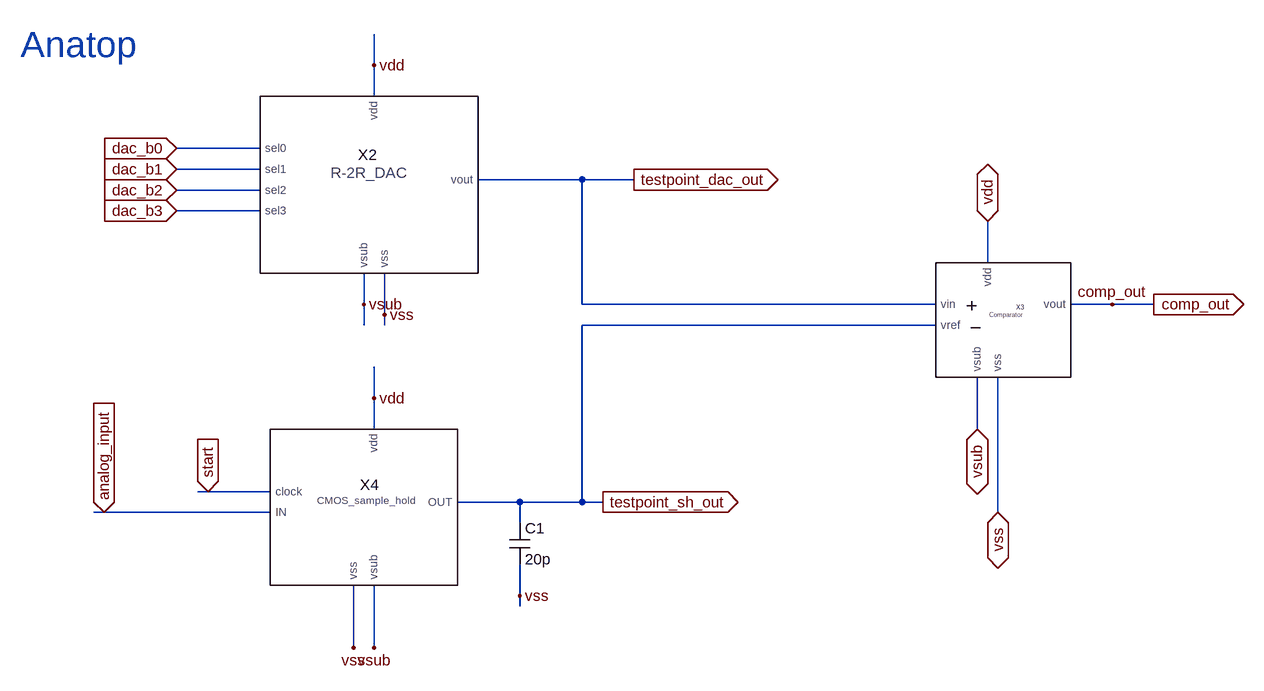
[diagram p0: schematic dsproj_anatop.asc]
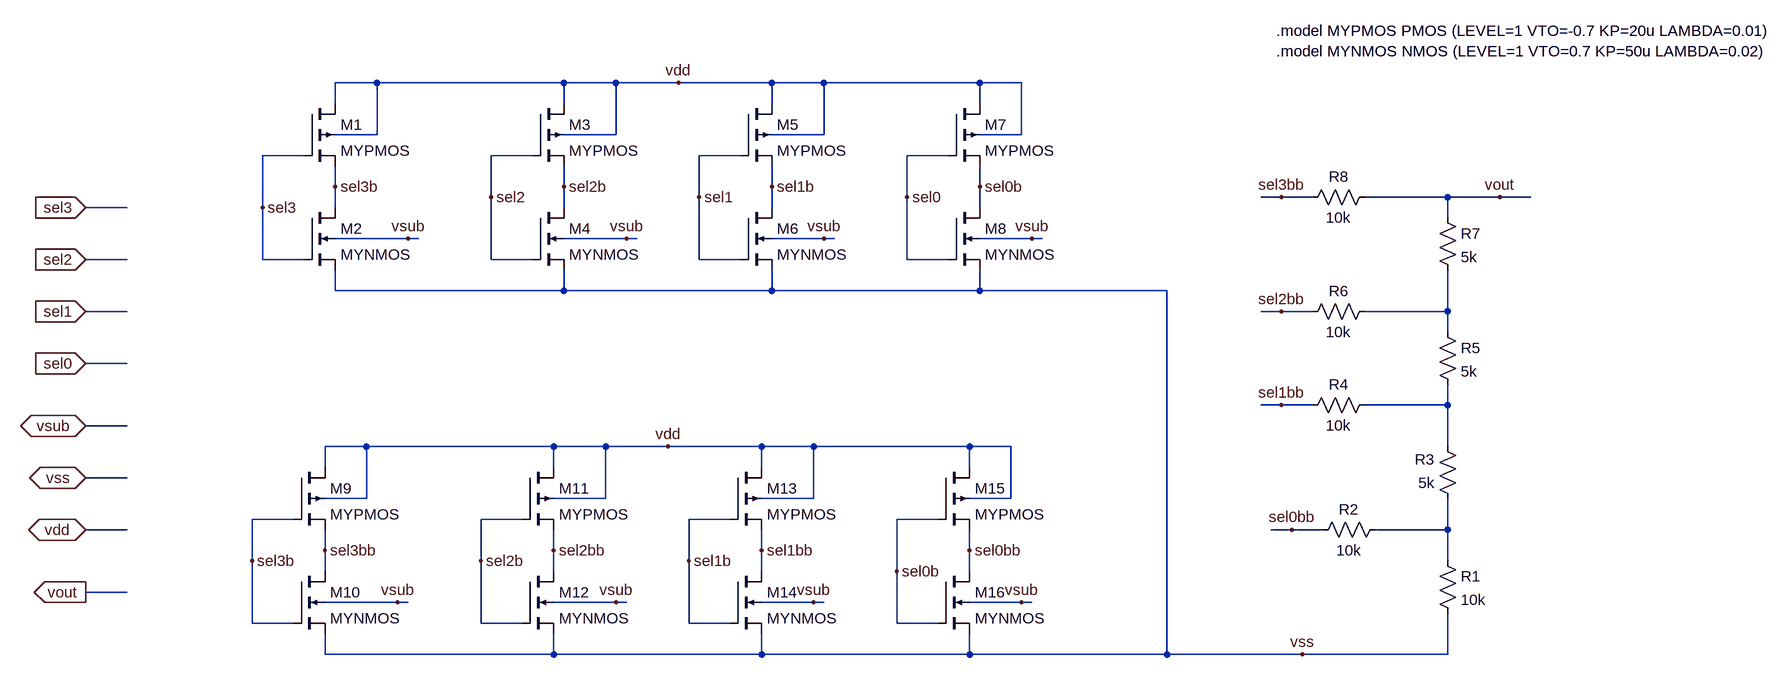
[diagram p1: sub-circuit dsproj_r2rdac.asc]
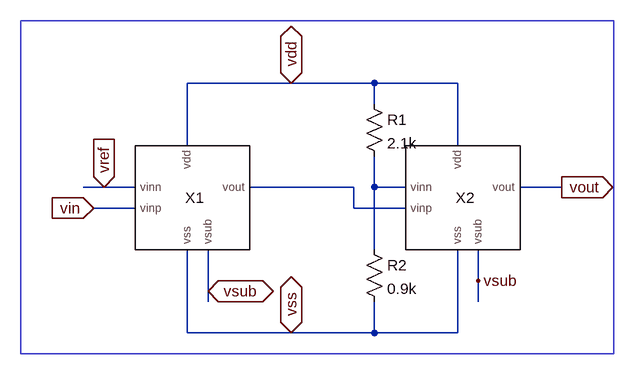
[diagram p2: sub-circuit dsproj_twostagecomparator.asc]
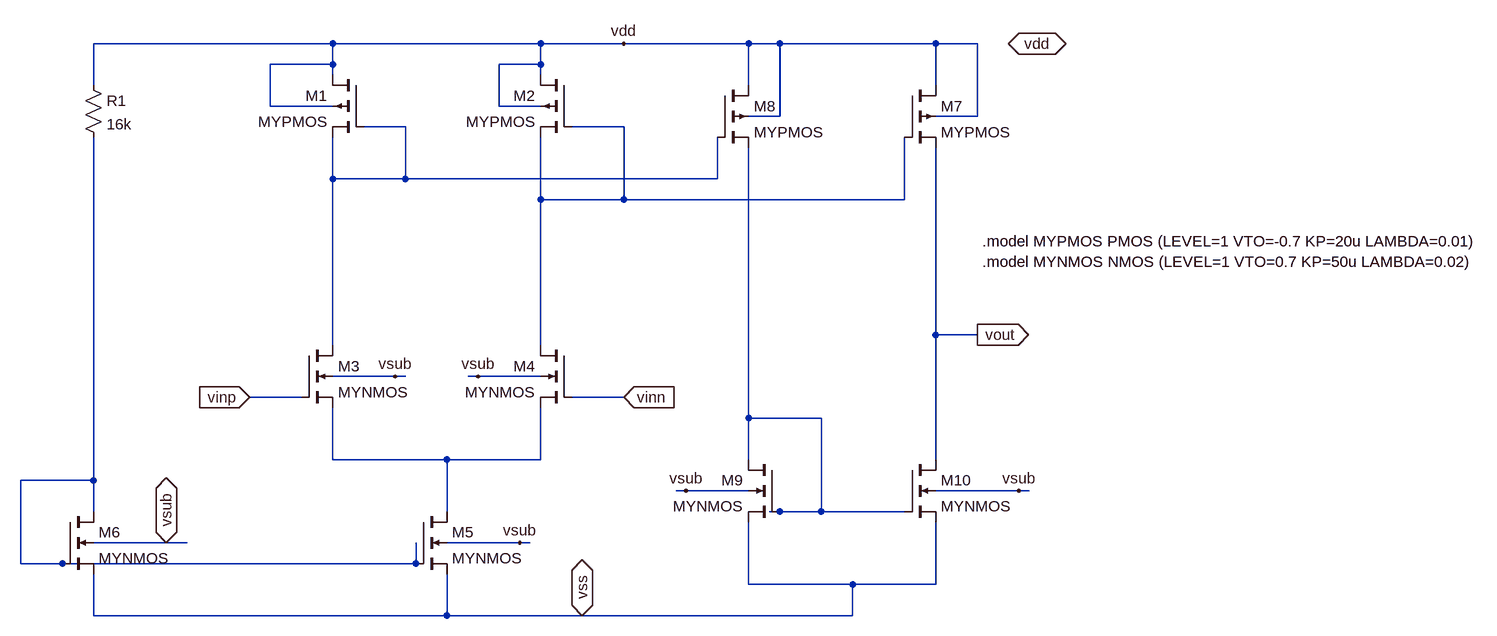
[diagram p3: sub-circuit dsproj_nmos_comparator.asc]
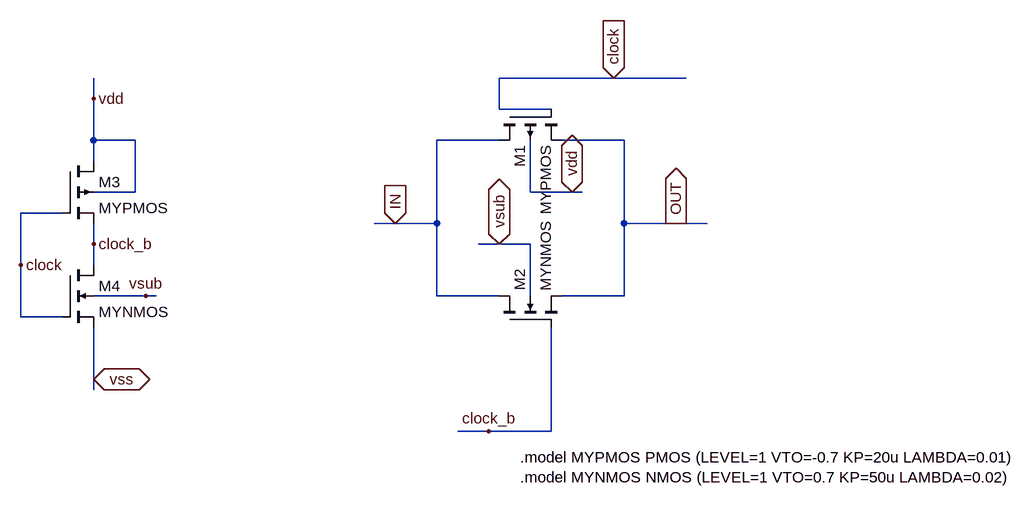
[diagram p4: sub-circuit dsproj_cmossampleandhold.asc]
dsproj_anatop.asc, the LTspice schematic file:
Version 4.1
SHEET 1 1348 1364
WIRE -320 -320 -320 -368
WIRE -320 -272 -320 -320
WIRE -496 -192 -624 -192
WIRE -496 -160 -624 -160
WIRE 0 -144 -160 -144
WIRE 80 -144 0 -144
WIRE -496 -128 -624 -128
WIRE -496 -96 -624 -96
WIRE 624 -16 624 -80
WIRE -336 48 -336 0
WIRE 0 48 0 -144
WIRE 544 48 0 48
WIRE 816 48 752 48
WIRE 880 48 816 48
WIRE -304 64 -304 0
WIRE -336 80 -336 48
WIRE -304 80 -304 64
WIRE 544 80 0 80
WIRE -320 192 -320 144
WIRE -320 240 -320 192
WIRE 608 240 608 160
WIRE -576 336 -592 336
WIRE -480 336 -576 336
WIRE -96 352 -192 352
WIRE 0 352 0 80
WIRE 0 352 -96 352
WIRE 32 352 0 352
WIRE -736 368 -752 368
WIRE -480 368 -736 368
WIRE 640 368 640 160
WIRE -96 384 -96 352
WIRE -96 496 -96 448
WIRE -96 512 -96 496
WIRE -352 576 -352 480
WIRE -320 576 -320 480
FLAG -320 -320 vdd
FLAG -320 192 vdd
FLAG 624 -80 vdd
IOPIN 624 -80 BiDir
FLAG -352 576 vss
FLAG -304 64 vss
FLAG 640 368 vss
IOPIN 640 368 BiDir
FLAG -320 576 vsub
FLAG -336 48 vsub
FLAG 608 240 vsub
IOPIN 608 240 BiDir
FLAG -624 -192 dac_b0
IOPIN -624 -192 In
FLAG -624 -160 dac_b1
IOPIN -624 -160 In
FLAG -624 -128 dac_b2
IOPIN -624 -128 In
FLAG -624 -96 dac_b3
IOPIN -624 -96 In
FLAG -576 336 start
IOPIN -576 336 In
FLAG 80 -144 testpoint_dac_out
IOPIN 80 -144 Out
FLAG 32 352 testpoint_sh_out
IOPIN 32 352 Out
FLAG 816 48 comp_out
FLAG -736 368 analog_input
IOPIN -736 368 In
FLAG 880 48 comp_out
IOPIN 880 48 Out
FLAG -96 496 vss
SYMBOL dsproj_r2rdac -400 -64 R0
SYMATTR InstName X2
SYMBOL dsproj_twostagecomparator 624 64 R0
SYMATTR InstName X3
SYMBOL cap -112 384 R0
SYMATTR InstName C1
SYMATTR Value 20p
SYMBOL dsproj_cmossampleandhold -336 384 R0
SYMATTR InstName X4
TEXT -864 -352 Left 5 ;Anatop

dsproj_r2rdac.asc, the sub-circuit schematic file:
Version 4.1
SHEET 1 2032 964
WIRE -144 -128 -208 -128
WIRE 144 -128 -144 -128
WIRE 224 -128 144 -128
WIRE 320 -128 224 -128
WIRE 464 -128 320 -128
WIRE 544 -128 464 -128
WIRE 784 -128 544 -128
WIRE 848 -128 784 -128
WIRE -208 -96 -208 -128
WIRE 144 -96 144 -128
WIRE 464 -96 464 -128
WIRE 784 -96 784 -128
WIRE -144 -48 -144 -128
WIRE -144 -48 -208 -48
WIRE 224 -48 224 -128
WIRE 224 -48 144 -48
WIRE 544 -48 544 -128
WIRE 544 -48 464 -48
WIRE 848 -48 848 -128
WIRE 848 -48 784 -48
WIRE -256 -16 -320 -16
WIRE 96 -16 32 -16
WIRE 416 -16 352 -16
WIRE 736 -16 672 -16
WIRE -208 32 -208 0
WIRE 144 32 144 0
WIRE 464 32 464 0
WIRE 784 32 784 0
WIRE 32 48 32 -16
WIRE 352 48 352 -16
WIRE 672 48 672 -16
WIRE 1248 48 1216 48
WIRE 1296 48 1248 48
WIRE 1504 48 1376 48
WIRE 1584 48 1504 48
WIRE 1632 48 1584 48
WIRE -528 64 -592 64
WIRE -320 64 -320 -16
WIRE -208 64 -208 32
WIRE 144 64 144 32
WIRE 464 64 464 32
WIRE 784 64 784 32
WIRE 1504 80 1504 48
WIRE -96 112 -208 112
WIRE -80 112 -96 112
WIRE 240 112 144 112
WIRE 256 112 240 112
WIRE 544 112 464 112
WIRE 560 112 544 112
WIRE 864 112 784 112
WIRE 880 112 864 112
WIRE -528 144 -592 144
WIRE -320 144 -320 64
WIRE -256 144 -320 144
WIRE 32 144 32 48
WIRE 96 144 32 144
WIRE 352 144 352 48
WIRE 416 144 352 144
WIRE 672 144 672 48
WIRE 736 144 672 144
WIRE -208 192 -208 160
WIRE 144 192 144 160
WIRE 144 192 -208 192
WIRE 464 192 464 160
WIRE 464 192 144 192
WIRE 784 192 784 160
WIRE 784 192 464 192
WIRE 1072 192 784 192
WIRE -528 224 -592 224
WIRE 1248 224 1216 224
WIRE 1296 224 1248 224
WIRE 1504 224 1504 160
WIRE 1504 224 1376 224
WIRE 1504 256 1504 224
WIRE -528 304 -592 304
WIRE 1248 368 1216 368
WIRE 1296 368 1248 368
WIRE 1504 368 1504 336
WIRE 1504 368 1376 368
WIRE -528 400 -592 400
WIRE -160 432 -224 432
WIRE 128 432 -160 432
WIRE 208 432 128 432
WIRE 304 432 208 432
WIRE 448 432 304 432
WIRE 528 432 448 432
WIRE 768 432 528 432
WIRE 832 432 768 432
WIRE 1504 432 1504 368
WIRE -224 464 -224 432
WIRE 128 464 128 432
WIRE 448 464 448 432
WIRE 768 464 768 432
WIRE -528 480 -592 480
WIRE -160 512 -160 432
WIRE -160 512 -224 512
WIRE 208 512 208 432
WIRE 208 512 128 512
WIRE 528 512 528 432
WIRE 528 512 448 512
WIRE 832 512 832 432
WIRE 832 512 768 512
WIRE -272 544 -336 544
WIRE 80 544 16 544
WIRE 400 544 336 544
WIRE 720 544 656 544
WIRE -528 560 -592 560
WIRE 1264 560 1232 560
WIRE 1312 560 1264 560
WIRE 1504 560 1504 512
WIRE 1504 560 1392 560
WIRE -224 592 -224 560
WIRE 128 592 128 560
WIRE 448 592 448 560
WIRE 768 592 768 560
WIRE -336 608 -336 544
WIRE 16 608 16 544
WIRE 336 608 336 544
WIRE 1504 608 1504 560
WIRE -224 624 -224 592
WIRE 128 624 128 592
WIRE 448 624 448 592
WIRE 656 624 656 544
WIRE 768 624 768 592
WIRE -528 656 -592 656
WIRE -112 672 -224 672
WIRE -96 672 -112 672
WIRE 224 672 128 672
WIRE 240 672 224 672
WIRE 528 672 448 672
WIRE 544 672 528 672
WIRE 848 672 768 672
WIRE 864 672 848 672
WIRE -336 704 -336 608
WIRE -272 704 -336 704
WIRE 16 704 16 608
WIRE 80 704 16 704
WIRE 336 704 336 608
WIRE 400 704 336 704
WIRE 656 704 656 624
WIRE 720 704 656 704
WIRE -224 752 -224 720
WIRE 128 752 128 720
WIRE 128 752 -224 752
WIRE 448 752 448 720
WIRE 448 752 128 752
WIRE 768 752 768 720
WIRE 768 752 448 752
WIRE 1072 752 1072 192
WIRE 1072 752 768 752
WIRE 1280 752 1072 752
WIRE 1504 752 1504 688
WIRE 1504 752 1280 752
FLAG 240 112 vsub
FLAG 544 112 vsub
FLAG 864 112 vsub
FLAG -96 112 vsub
FLAG 320 -128 vdd
FLAG 224 672 vsub
FLAG 528 672 vsub
FLAG 848 672 vsub
FLAG -112 672 vsub
FLAG 304 432 vdd
FLAG 672 48 sel0
FLAG 352 48 sel1
FLAG 32 48 sel2
FLAG -320 64 sel3
FLAG 656 624 sel0b
FLAG 336 608 sel1b
FLAG 16 608 sel2b
FLAG -336 608 sel3b
FLAG -208 32 sel3b
FLAG 144 32 sel2b
FLAG 464 32 sel1b
FLAG 784 32 sel0b
FLAG -224 592 sel3bb
FLAG 128 592 sel2bb
FLAG 448 592 sel1bb
FLAG 768 592 sel0bb
FLAG 1280 752 vss
FLAG 1584 48 vout
FLAG 1264 560 sel0bb
FLAG 1248 368 sel1bb
FLAG 1248 224 sel2bb
FLAG 1248 48 sel3bb
FLAG -592 560 vdd
IOPIN -592 560 BiDir
FLAG -592 480 vss
IOPIN -592 480 BiDir
FLAG -592 400 vsub
IOPIN -592 400 BiDir
FLAG -592 304 sel0
IOPIN -592 304 In
FLAG -592 224 sel1
IOPIN -592 224 In
FLAG -592 144 sel2
IOPIN -592 144 In
FLAG -592 64 sel3
IOPIN -592 64 In
FLAG -592 656 vout
IOPIN -592 656 Out
SYMBOL pmos4 -256 -96 R0
SYMATTR InstName M1
SYMATTR Value MYPMOS
SYMATTR Value2 l=180e-9 w=2.4e-6
SYMBOL nmos4 -256 64 R0
SYMATTR InstName M2
SYMATTR Value MYNMOS
SYMATTR Value2 l=180e-9 w=1.2e-6
SYMBOL pmos4 96 -96 R0
SYMATTR InstName M3
SYMATTR Value MYPMOS
SYMATTR Value2 l=180e-9 w=2.4e-6 m=1
SYMBOL nmos4 96 64 R0
SYMATTR InstName M4
SYMATTR Value MYNMOS
SYMATTR Value2 l=180e-9 w=1.2e-6 m=1
SYMBOL pmos4 416 -96 R0
SYMATTR InstName M5
SYMATTR Value MYPMOS
SYMATTR Value2 l=180e-9 w=2.4e-6 m=1
SYMBOL nmos4 416 64 R0
SYMATTR InstName M6
SYMATTR Value MYNMOS
SYMATTR Value2 l=180e-9 w=1.2e-6 m=1
SYMBOL pmos4 736 -96 R0
SYMATTR InstName M7
SYMATTR Value MYPMOS
SYMATTR Value2 l=180e-9 w=2.4e-6 m=1
SYMBOL nmos4 736 64 R0
SYMATTR InstName M8
SYMATTR Value MYNMOS
SYMATTR Value2 l=180e-9 w=1.2e-6 m=1
SYMBOL pmos4 -272 464 R0
SYMATTR InstName M9
SYMATTR Value MYPMOS
SYMATTR Value2 l=180e-9 w=2.4e-6 m=1
SYMBOL nmos4 -272 624 R0
SYMATTR InstName M10
SYMATTR Value MYNMOS
SYMATTR Value2 l=180e-9 w=1.2e-6 m=1
SYMBOL pmos4 80 464 R0
SYMATTR InstName M11
SYMATTR Value MYPMOS
SYMATTR Value2 l=180e-9 w=2.4e-6 m=1
SYMBOL nmos4 80 624 R0
SYMATTR InstName M12
SYMATTR Value MYNMOS
SYMATTR Value2 l=180e-9 w=1.2e-6 m=1
SYMBOL pmos4 400 464 R0
SYMATTR InstName M13
SYMATTR Value MYPMOS
SYMATTR Value2 l=180e-9 w=2.4e-6 m=1
SYMBOL nmos4 400 624 R0
SYMATTR InstName M14
SYMATTR Value MYNMOS
SYMATTR Value2 l=180e-9 w=1.2e-6 m=1
SYMBOL pmos4 720 464 R0
SYMATTR InstName M15
SYMATTR Value MYPMOS
SYMATTR Value2 l=180e-9 w=2.4e-6 m=1
SYMBOL nmos4 720 624 R0
SYMATTR InstName M16
SYMATTR Value MYNMOS
SYMATTR Value2 l=180e-9 w=1.2e-6 m=1
SYMBOL res 1488 592 R0
SYMATTR InstName R1
SYMATTR Value 10k
SYMBOL res 1408 544 R90
WINDOW 0 0 56 VBottom 2
WINDOW 3 32 56 VTop 2
SYMATTR InstName R2
SYMATTR Value 10k
SYMBOL res 1520 528 R180
WINDOW 0 36 76 Left 2
WINDOW 3 36 40 Left 2
SYMATTR InstName R3
SYMATTR Value 5k
SYMBOL res 1280 384 R270
WINDOW 0 32 56 VTop 2
WINDOW 3 0 56 VBottom 2
SYMATTR InstName R4
SYMATTR Value 10k
SYMBOL res 1488 240 R0
SYMATTR InstName R5
SYMATTR Value 5k
SYMBOL res 1392 208 R90
WINDOW 0 0 56 VBottom 2
WINDOW 3 32 56 VTop 2
SYMATTR InstName R6
SYMATTR Value 10k
SYMBOL res 1488 64 R0
SYMATTR InstName R7
SYMATTR Value 5k
SYMBOL res 1392 32 R90
WINDOW 0 0 56 VBottom 2
WINDOW 3 32 56 VTop 2
SYMATTR InstName R8
SYMATTR Value 10k
TEXT 1240 -208 Left 2 !.model MYPMOS PMOS (LEVEL=1 VTO=-0.7 KP=20u LAMBDA=0.01)\n.model MYNMOS NMOS (LEVEL=1 VTO=0.7 KP=50u LAMBDA=0.02)

dsproj_twostagecomparator.asc, the sub-circuit schematic file:
Version 4
SHEET 1 880 680
WIRE 160 -32 0 -32
WIRE 288 -32 160 -32
WIRE 416 -32 288 -32
WIRE 288 0 288 -32
WIRE 0 64 0 -32
WIRE 416 64 416 -32
WIRE -128 128 -160 128
WIRE -80 128 -128 128
WIRE 256 128 96 128
WIRE 288 128 288 80
WIRE 336 128 288 128
WIRE 576 128 512 128
WIRE -80 160 -144 160
WIRE 256 160 256 128
WIRE 336 160 256 160
WIRE 288 224 288 128
WIRE 448 272 448 224
WIRE 32 288 32 224
WIRE 32 304 32 288
WIRE 448 304 448 272
WIRE 0 352 0 224
WIRE 160 352 0 352
WIRE 288 352 288 304
WIRE 288 352 160 352
WIRE 416 352 416 224
WIRE 416 352 288 352
FLAG 32 288 vsub
IOPIN 32 288 BiDir
FLAG 448 272 vsub
FLAG 160 -32 vdd
IOPIN 160 -32 BiDir
FLAG 160 352 vss
IOPIN 160 352 BiDir
FLAG -128 128 vref
IOPIN -128 128 In
FLAG -144 160 vin
IOPIN -144 160 In
FLAG 576 128 vout
IOPIN 576 128 Out
SYMBOL dsproj_nmos_comparator 0 144 R0
SYMATTR InstName X1
SYMBOL dsproj_nmos_comparator 416 144 R0
SYMATTR InstName X2
SYMBOL res 272 -16 R0
SYMATTR InstName R1
SYMATTR Value 2.1k
SYMBOL res 272 208 R0
SYMATTR InstName R2
SYMATTR Value 0.9k
RECTANGLE Normal 656 384 -256 -128

dsproj_nmos_comparator.asc, the sub-circuit schematic file:
Version 4.1
SHEET 1 1360 680
WIRE -432 -416 -800 -416
WIRE -112 -416 -432 -416
WIRE 16 -416 -112 -416
WIRE 208 -416 16 -416
WIRE 256 -416 208 -416
WIRE 496 -416 256 -416
WIRE 560 -416 496 -416
WIRE -432 -384 -432 -416
WIRE -432 -384 -528 -384
WIRE -112 -384 -112 -416
WIRE -112 -384 -176 -384
WIRE -432 -368 -432 -384
WIRE -112 -368 -112 -384
WIRE -800 -352 -800 -416
WIRE 208 -352 208 -416
WIRE 496 -352 496 -416
WIRE -528 -320 -528 -384
WIRE -432 -320 -528 -320
WIRE -176 -320 -176 -384
WIRE -112 -320 -176 -320
WIRE 256 -304 256 -416
WIRE 256 -304 208 -304
WIRE 560 -304 560 -416
WIRE 560 -304 496 -304
WIRE -320 -288 -384 -288
WIRE 16 -288 -64 -288
WIRE -432 -208 -432 -272
WIRE -320 -208 -320 -288
WIRE -320 -208 -432 -208
WIRE 160 -208 160 -272
WIRE 160 -208 -320 -208
WIRE -112 -176 -112 -272
WIRE 16 -176 16 -288
WIRE 16 -176 -112 -176
WIRE 448 -176 448 -272
WIRE 448 -176 16 -176
WIRE 496 32 496 -256
WIRE 560 32 496 32
WIRE -432 48 -432 -208
WIRE -112 48 -112 -176
WIRE -336 96 -432 96
WIRE -320 96 -336 96
WIRE -208 96 -224 96
WIRE -112 96 -208 96
WIRE -480 128 -560 128
WIRE 16 128 -64 128
WIRE 208 160 208 -256
WIRE 320 160 208 160
WIRE -432 224 -432 144
WIRE -256 224 -432 224
WIRE -112 224 -112 144
WIRE -112 224 -256 224
WIRE 208 224 208 160
WIRE 496 224 496 32
WIRE -800 256 -800 -272
WIRE -800 256 -912 256
WIRE 112 272 96 272
WIRE 208 272 112 272
WIRE 624 272 496 272
WIRE 640 272 624 272
WIRE -800 304 -800 256
WIRE -256 304 -256 224
WIRE 256 304 240 304
WIRE 320 304 320 160
WIRE 320 304 256 304
WIRE 448 304 320 304
WIRE -688 352 -800 352
WIRE -656 352 -688 352
WIRE -144 352 -256 352
WIRE -128 352 -144 352
WIRE -912 384 -912 256
WIRE -848 384 -912 384
WIRE -304 384 -304 352
WIRE -304 384 -848 384
WIRE 208 416 208 320
WIRE 368 416 208 416
WIRE 496 416 496 320
WIRE 496 416 368 416
WIRE -800 464 -800 400
WIRE -256 464 -256 400
WIRE -256 464 -800 464
WIRE -48 464 -256 464
WIRE 368 464 368 416
WIRE 368 464 -48 464
FLAG -208 96 vsub
FLAG 560 32 vout
IOPIN 560 32 Out
FLAG 608 -416 vdd
IOPIN 608 -416 BiDir
FLAG -560 128 vinp
IOPIN -560 128 In
FLAG 16 128 vinn
IOPIN 16 128 In
FLAG 112 272 vsub
FLAG 624 272 vsub
FLAG -48 464 vss
IOPIN -48 464 BiDir
FLAG -688 352 vsub
IOPIN -688 352 BiDir
FLAG -144 352 vsub
FLAG 16 -416 vdd
FLAG -336 96 vsub
SYMBOL pmos4 -384 -368 M0
SYMATTR InstName M1
SYMATTR Value MYPMOS
SYMATTR Value2 l=180e-9 w=1.2e-6 m=2
SYMBOL pmos4 -64 -368 M0
SYMATTR InstName M2
SYMATTR Value MYPMOS
SYMATTR Value2 l=180e-9 w=1.2e-6 m=2
SYMBOL nmos4 -64 48 M0
SYMATTR InstName M4
SYMATTR Value MYNMOS
SYMATTR Value2 l=180e-9 w=1.2e-6 m=3
SYMBOL nmos4 -304 304 R0
SYMATTR InstName M5
SYMATTR Value MYNMOS
SYMATTR Value2 l=3e-6 w=10e-6 m=2
SYMBOL res -816 -368 R0
SYMATTR InstName R1
SYMATTR Value 16k
SYMBOL nmos4 -848 304 R0
SYMATTR InstName M6
SYMATTR Value MYNMOS
SYMATTR Value2 l=3e-6 w=10e-6 m=2
SYMBOL nmos4 -480 48 R0
SYMATTR InstName M3
SYMATTR Value MYNMOS
SYMATTR Value2 l=180e-9 w=1.2e-6 m=3
SYMBOL pmos4 448 -352 R0
SYMATTR InstName M7
SYMATTR Value MYPMOS
SYMATTR Value2 l=180e-9 w=1.2e-6 m=2
SYMBOL pmos4 160 -352 R0
SYMATTR InstName M8
SYMATTR Value MYPMOS
SYMATTR Value2 l=180e-9 w=1.2e-6 m=2
SYMBOL nmos4 256 224 M0
SYMATTR InstName M9
SYMATTR Value MYNMOS
SYMATTR Value2 l=180e-9 w=1.2e-6 m=1
SYMBOL nmos4 448 224 R0
SYMATTR InstName M10
SYMATTR Value MYNMOS
SYMATTR Value2 l=180e-9 w=1.2e-6 m=1
TEXT 568 -112 Left 2 !.model MYPMOS PMOS (LEVEL=1 VTO=-0.7 KP=20u LAMBDA=0.01)\n.model MYNMOS NMOS (LEVEL=1 VTO=0.7 KP=50u LAMBDA=0.02)

dsproj_cmossampleandhold.asc, the sub-circuit schematic file:
Version 4.1
SHEET 1 1400 756
WIRE 128 -208 -48 -208
WIRE 240 -208 128 -208
WIRE -672 -176 -672 -208
WIRE -48 -160 -48 -208
WIRE 32 -160 -48 -160
WIRE -672 -112 -672 -176
WIRE -608 -112 -672 -112
WIRE -48 -112 -144 -112
WIRE 144 -112 48 -112
WIRE -672 -80 -672 -112
WIRE -608 -32 -608 -112
WIRE -608 -32 -672 -32
WIRE 0 -32 0 -112
WIRE 64 -32 0 -32
WIRE 80 -32 64 -32
WIRE -720 0 -784 0
WIRE -208 16 -240 16
WIRE -144 16 -144 -112
WIRE -144 16 -208 16
WIRE 144 16 144 -112
WIRE 224 16 144 16
WIRE 272 16 224 16
WIRE -672 48 -672 16
WIRE -48 48 -80 48
WIRE 0 48 -48 48
WIRE -784 80 -784 0
WIRE -672 80 -672 48
WIRE -592 128 -672 128
WIRE -576 128 -592 128
WIRE -144 128 -144 16
WIRE -48 128 -144 128
WIRE 0 128 0 48
WIRE 144 128 144 16
WIRE 144 128 48 128
WIRE -784 160 -784 80
WIRE -720 160 -784 160
WIRE -672 256 -672 176
WIRE -672 272 -672 256
WIRE -64 336 -112 336
WIRE 32 336 32 176
WIRE 32 336 -64 336
FLAG 128 -208 clock
IOPIN 128 -208 In
FLAG 64 -32 vdd
IOPIN 64 -32 BiDir
FLAG -48 48 vsub
IOPIN -48 48 BiDir
FLAG -208 16 IN
IOPIN -208 16 In
FLAG 224 16 OUT
IOPIN 224 16 Out
FLAG -592 128 vsub
FLAG -672 -176 vdd
FLAG -784 80 clock
FLAG -672 48 clock_b
FLAG -64 336 clock_b
FLAG -672 256 vss
IOPIN -672 256 BiDir
SYMBOL pmos4 -48 -160 M90
SYMATTR InstName M1
SYMATTR Value MYPMOS
SYMATTR Value2 l=180e-9 w=2400e-9
SYMBOL nmos4 -48 176 R270
SYMATTR InstName M2
SYMATTR Value MYNMOS
SYMATTR Value2 l=180e-9 w=1200e-9
SYMBOL pmos4 -720 -80 R0
SYMATTR InstName M3
SYMATTR Value MYPMOS
SYMATTR Value2 l=180e-9 w=2.4e-6 m=1
SYMBOL nmos4 -720 80 R0
SYMATTR InstName M4
SYMATTR Value MYNMOS
SYMATTR Value2 l=180e-9 w=1.2e-6 m=1
TEXT -16 376 Left 2 !.model MYPMOS PMOS (LEVEL=1 VTO=-0.7 KP=20u LAMBDA=0.01)\n.model MYNMOS NMOS (LEVEL=1 VTO=0.7 KP=50u LAMBDA=0.02)

The netlist it stands for:
* dsproj_anatop.asc
X§X2 dac_b0 dac_b1 dac_b2 dac_b3 vdd testpoint_dac_out vss vsub dsproj_r2rdac
X§X3 testpoint_dac_out testpoint_sh_out vdd comp_out vss vsub dsproj_twostagecomparator
C1 testpoint_sh_out vss 20p
X§X4 analog_input start testpoint_sh_out vdd vsub vss dsproj_cmossampleandhold

* block symbol definitions
.subckt dsproj_r2rdac sel0 sel1 sel2 sel3 vdd vout vss vsub
M1 vdd sel3 sel3b vdd MYPMOS l=180e-9 w=2.4e-6
M2 sel3b sel3 vss vsub MYNMOS l=180e-9 w=1.2e-6
M3 vdd sel2 sel2b vdd MYPMOS l=180e-9 w=2.4e-6 m=1
M4 sel2b sel2 vss vsub MYNMOS l=180e-9 w=1.2e-6 m=1
M5 vdd sel1 sel1b vdd MYPMOS l=180e-9 w=2.4e-6 m=1
M6 sel1b sel1 vss vsub MYNMOS l=180e-9 w=1.2e-6 m=1
M7 vdd sel0 sel0b vdd MYPMOS l=180e-9 w=2.4e-6 m=1
M8 sel0b sel0 vss vsub MYNMOS l=180e-9 w=1.2e-6 m=1
M9 vdd sel3b sel3bb vdd MYPMOS l=180e-9 w=2.4e-6 m=1
M10 sel3bb sel3b vss vsub MYNMOS l=180e-9 w=1.2e-6 m=1
M11 vdd sel2b sel2bb vdd MYPMOS l=180e-9 w=2.4e-6 m=1
M12 sel2bb sel2b vss vsub MYNMOS l=180e-9 w=1.2e-6 m=1
M13 vdd sel1b sel1bb vdd MYPMOS l=180e-9 w=2.4e-6 m=1
M14 sel1bb sel1b vss vsub MYNMOS l=180e-9 w=1.2e-6 m=1
M15 vdd sel0b sel0bb vdd MYPMOS l=180e-9 w=2.4e-6 m=1
M16 sel0bb sel0b vss vsub MYNMOS l=180e-9 w=1.2e-6 m=1
R1 N003 vss 10k
R2 N003 sel0bb 10k
R3 N003 N002 5k
R4 sel1bb N002 10k
R5 N001 N002 5k
R6 N001 sel2bb 10k
R7 vout N001 5k
R8 vout sel3bb 10k
.model MYPMOS PMOS (LEVEL=1 VTO=-0.7 KP=20u LAMBDA=0.01)
.model MYNMOS NMOS (LEVEL=1 VTO=0.7 KP=50u LAMBDA=0.02)
.ends dsproj_r2rdac

.subckt dsproj_twostagecomparator vin vref vdd vout vss vsub
XX1 vref vin vdd N001 vss vsub dsproj_nmos_comparator
XX2 N002 N001 vdd vout vss vsub dsproj_nmos_comparator
R1 vdd N002 2.1k
R2 N002 vss 0.9k
.ends dsproj_twostagecomparator

.subckt dsproj_nmos_comparator vinn vinp vdd vout vss vsub
M1 vdd N001 N001 vdd MYPMOS l=180e-9 w=1.2e-6 m=2
M2 vdd N002 N002 vdd MYPMOS l=180e-9 w=1.2e-6 m=2
M4 N002 vinn N004 vsub MYNMOS l=180e-9 w=1.2e-6 m=3
M5 N004 N005 vss vsub MYNMOS l=3e-6 w=10e-6 m=2
R1 vdd N005 16k
M6 N005 N005 vss vsub MYNMOS l=3e-6 w=10e-6 m=2
M3 N001 vinp N004 vsub MYNMOS l=180e-9 w=1.2e-6 m=3
M7 vdd N002 vout vdd MYPMOS l=180e-9 w=1.2e-6 m=2
M8 vdd N001 N003 vdd MYPMOS l=180e-9 w=1.2e-6 m=2
M9 N003 N003 vss vsub MYNMOS l=180e-9 w=1.2e-6 m=1
M10 vout N003 vss vsub MYNMOS l=180e-9 w=1.2e-6 m=1
.model MYPMOS PMOS (LEVEL=1 VTO=-0.7 KP=20u LAMBDA=0.01)
.model MYNMOS NMOS (LEVEL=1 VTO=0.7 KP=50u LAMBDA=0.02)
.ends dsproj_nmos_comparator

.subckt dsproj_cmossampleandhold IN clock OUT vdd vsub vss
M1 IN clock OUT vdd MYPMOS l=180e-9 w=2400e-9
M2 IN clock_b OUT vsub MYNMOS l=180e-9 w=1200e-9
M3 vdd clock clock_b vdd MYPMOS l=180e-9 w=2.4e-6 m=1
M4 clock_b clock vss vsub MYNMOS l=180e-9 w=1.2e-6 m=1
.model MYPMOS PMOS (LEVEL=1 VTO=-0.7 KP=20u LAMBDA=0.01)
.model MYNMOS NMOS (LEVEL=1 VTO=0.7 KP=50u LAMBDA=0.02)
.ends dsproj_cmossampleandhold

.model NMOS NMOS
.model PMOS PMOS
.lib standard.mos
* Anatop
.backanno
.end